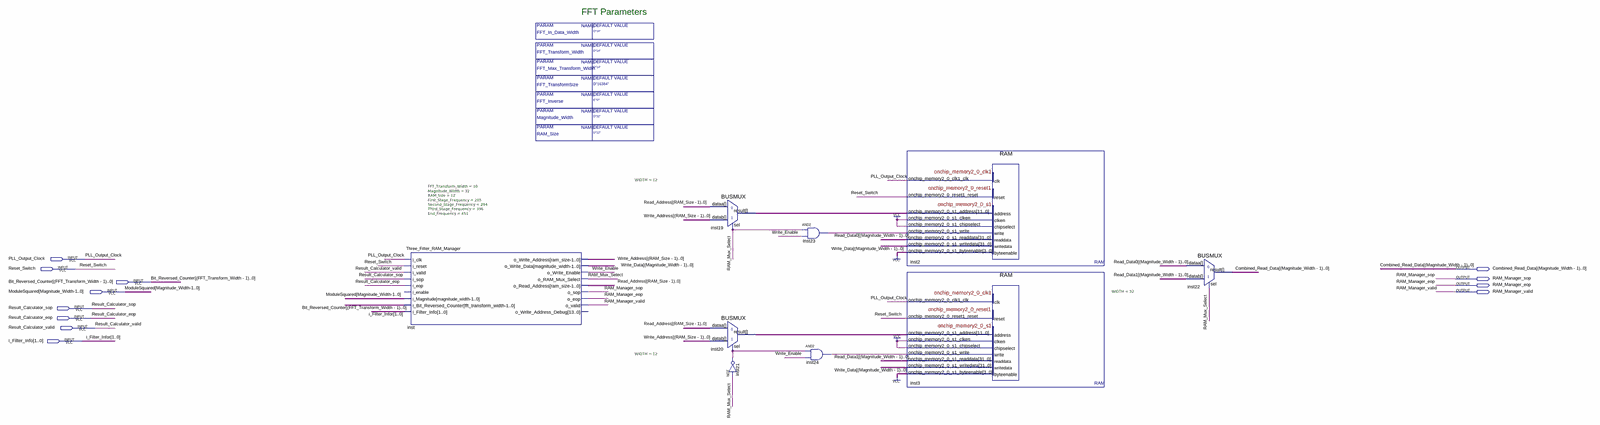
[diagram p0: schematic sheet, whole]
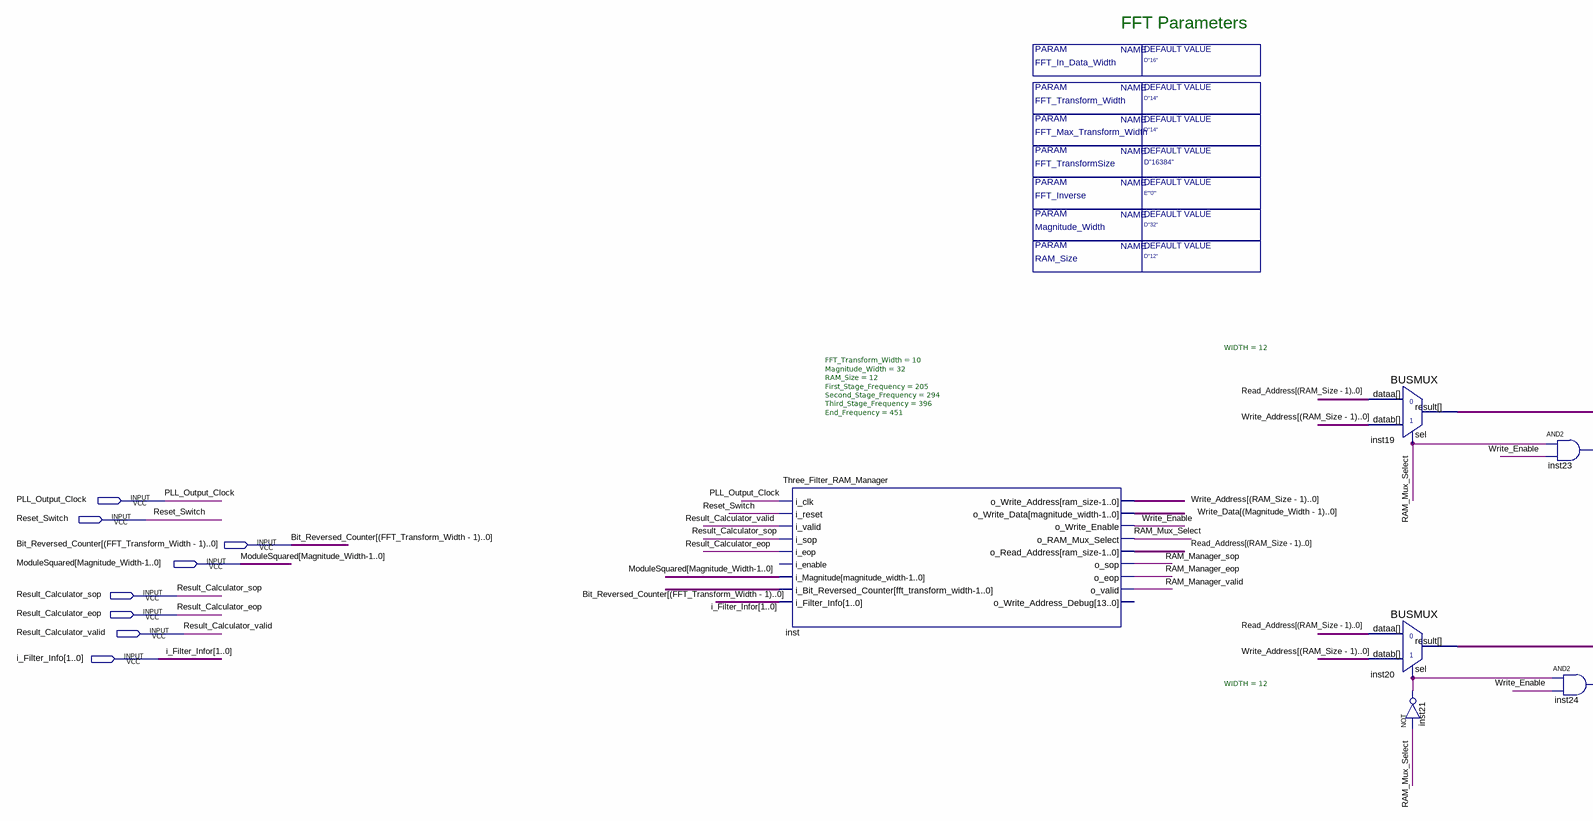
[diagram p1: schematic sheet, left part]
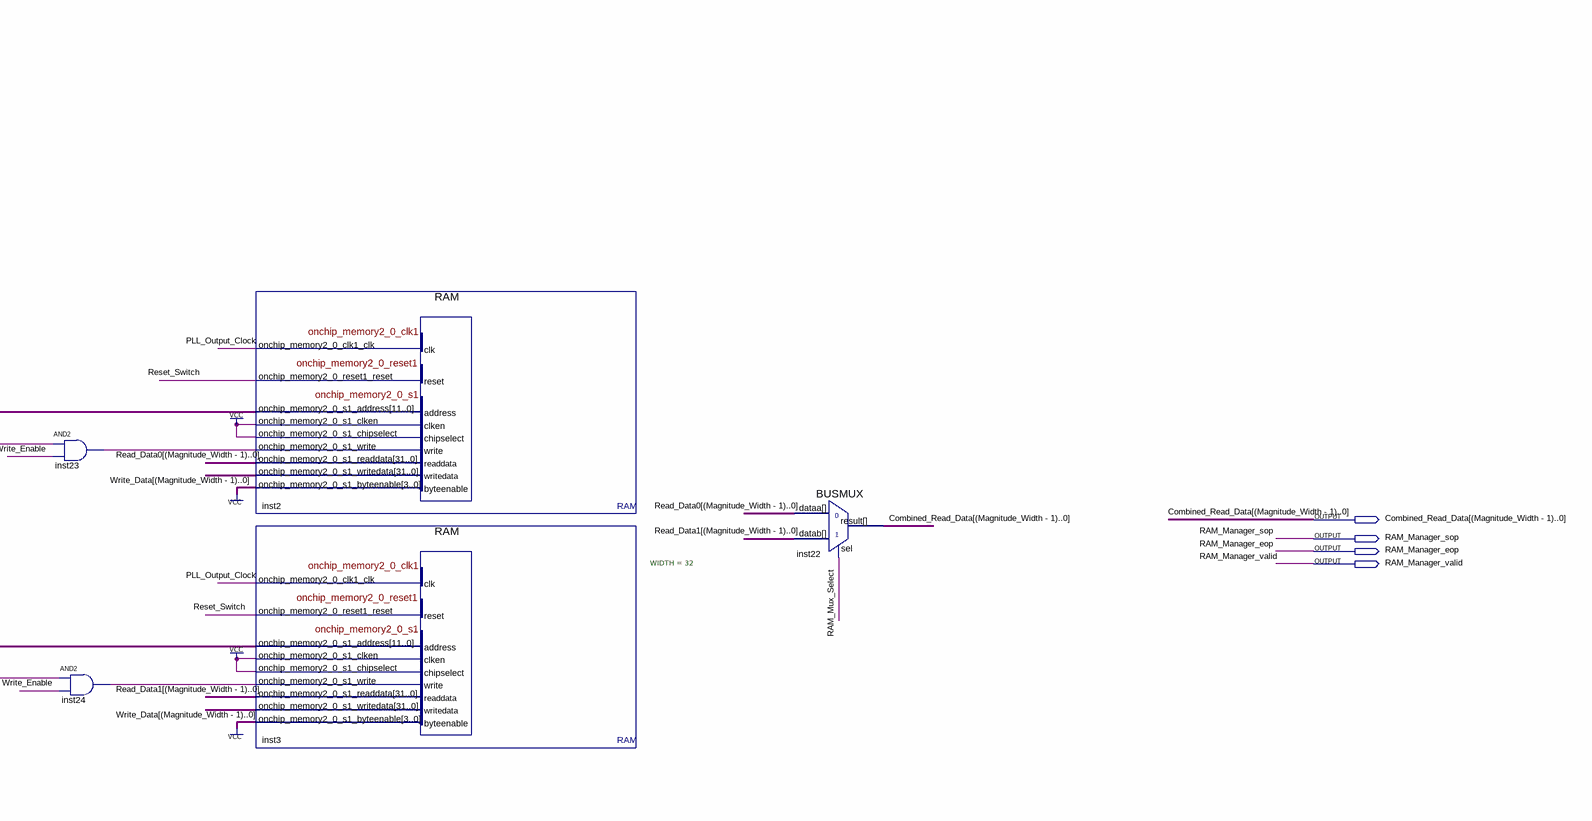
[diagram p2: schematic sheet, right part]
// Quartus schematic Three_Filter_RAM_Manager_Block.bdf as structural Verilog: 9 symbols, 12 pins
module Three_Filter_RAM_Manager_Block #(parameter FFT_Inverse = "E\"'0'\"", parameter FFT_In_Data_Width = "D\"16\"", parameter Magnitude_Width = "D\"32\"", parameter FFT_Transform_Width = "D\"14\"", parameter FFT_Max_Transform_Width = "D\"14\"", parameter FFT_TransformSize = "D\"16384\"", parameter RAM_Size = "D\"12\"") (
  input  PLL_Output_Clock,
  input  Reset_Switch,
  input  \Bit_Reversed_Counter[(FFT_Transform_Width_-_1)..0] ,
  input  \ModuleSquared[Magnitude_Width-1..0] ,
  input  Result_Calculator_sop,
  input  Result_Calculator_eop,
  input  Result_Calculator_valid,
  input  [1:0] i_Filter_Info,
  output \Combined_Read_Data[(Magnitude_Width_-_1)..0] ,
  output RAM_Manager_sop,
  output RAM_Manager_eop,
  output RAM_Manager_valid
);

  wire inst21_out, inst23_out, inst24_out, RAM_Mux_Select, \Read_Address[(RAM_Size_-_1)..0] ,
       \Read_Data0[(Magnitude_Width_-_1)..0] , \Read_Data1[(Magnitude_Width_-_1)..0] ,
       \Write_Address[(RAM_Size_-_1)..0] , \Write_Data[(Magnitude_Width_-_1)..0] , Write_Enable;
  wire [11:0] inst19_result, inst20_result;

  Three_Filter_RAM_Manager #(.FFT_Transform_Width(10), .Magnitude_Width(32), .RAM_Size(12), .First_Stage_Frequency(205), .Second_Stage_Frequency(294), .Third_Stage_Frequency(396), .End_Frequency(451)) inst (
    .i_clk(PLL_Output_Clock), .i_reset(Reset_Switch), .i_valid(Result_Calculator_valid),
    .i_sop(Result_Calculator_sop), .i_eop(Result_Calculator_eop),
    .i_Magnitude({32{\ModuleSquared[Magnitude_Width-1..0] }}),
    .i_Bit_Reversed_Counter({10{\Bit_Reversed_Counter[(FFT_Transform_Width_-_1)..0] }}),
    .i_Filter_Info(i_Filter_Info), .o_Write_Address(\Write_Address[(RAM_Size_-_1)..0] ),
    .o_Write_Data(\Write_Data[(Magnitude_Width_-_1)..0] ), .o_Write_Enable(Write_Enable),
    .o_RAM_Mux_Select(RAM_Mux_Select), .o_Read_Address(\Read_Address[(RAM_Size_-_1)..0] ),
    .o_sop(RAM_Manager_sop), .o_eop(RAM_Manager_eop), .o_valid(RAM_Manager_valid));  // open: i_enable, o_Write_Address_Debug
  BUSMUX #(.WIDTH(12)) inst19 (
    .datab({12{\Write_Address[(RAM_Size_-_1)..0] }}), .sel(RAM_Mux_Select),
    .dataa({12{\Read_Address[(RAM_Size_-_1)..0] }}), .result(inst19_result));
  BUSMUX #(.WIDTH(12)) inst20 (
    .datab({12{\Write_Address[(RAM_Size_-_1)..0] }}), .sel(inst21_out),
    .dataa({12{\Read_Address[(RAM_Size_-_1)..0] }}), .result(inst20_result));
  not inst21 (inst21_out, RAM_Mux_Select);
  and inst23 (inst23_out, RAM_Mux_Select, Write_Enable);
  and inst24 (inst24_out, inst21_out, Write_Enable);
  RAM inst2 (
    .onchip_memory2_0_clk1_clk(PLL_Output_Clock), .onchip_memory2_0_reset1_reset(Reset_Switch),
    .onchip_memory2_0_s1_address(inst19_result), .onchip_memory2_0_s1_clken(1'b1),
    .onchip_memory2_0_s1_chipselect(1'b1), .onchip_memory2_0_s1_write(inst23_out),
    .onchip_memory2_0_s1_writedata({32{\Write_Data[(Magnitude_Width_-_1)..0] }}),
    .onchip_memory2_0_s1_byteenable(4'b1111),
    .onchip_memory2_0_s1_readdata(\Read_Data0[(Magnitude_Width_-_1)..0] ));
  RAM inst3 (
    .onchip_memory2_0_clk1_clk(PLL_Output_Clock), .onchip_memory2_0_reset1_reset(Reset_Switch),
    .onchip_memory2_0_s1_address(inst20_result), .onchip_memory2_0_s1_clken(1'b1),
    .onchip_memory2_0_s1_chipselect(1'b1), .onchip_memory2_0_s1_write(inst24_out),
    .onchip_memory2_0_s1_writedata({32{\Write_Data[(Magnitude_Width_-_1)..0] }}),
    .onchip_memory2_0_s1_byteenable(4'b1111),
    .onchip_memory2_0_s1_readdata(\Read_Data1[(Magnitude_Width_-_1)..0] ));
  BUSMUX #(.WIDTH(32)) inst22 (
    .datab({32{\Read_Data1[(Magnitude_Width_-_1)..0] }}), .sel(RAM_Mux_Select),
    .dataa({32{\Read_Data0[(Magnitude_Width_-_1)..0] }}),
    .result(\Combined_Read_Data[(Magnitude_Width_-_1)..0] ));

  // Other names for the same wires on the sheet: i_Filter_Infor[1:0] = i_Filter_Info

  // Notes on the sheet:
  //   FFT Parameters
endmodule
